# EAGLE design BPW21_transimpedance_amplifier (EAGLE 9.6.2)
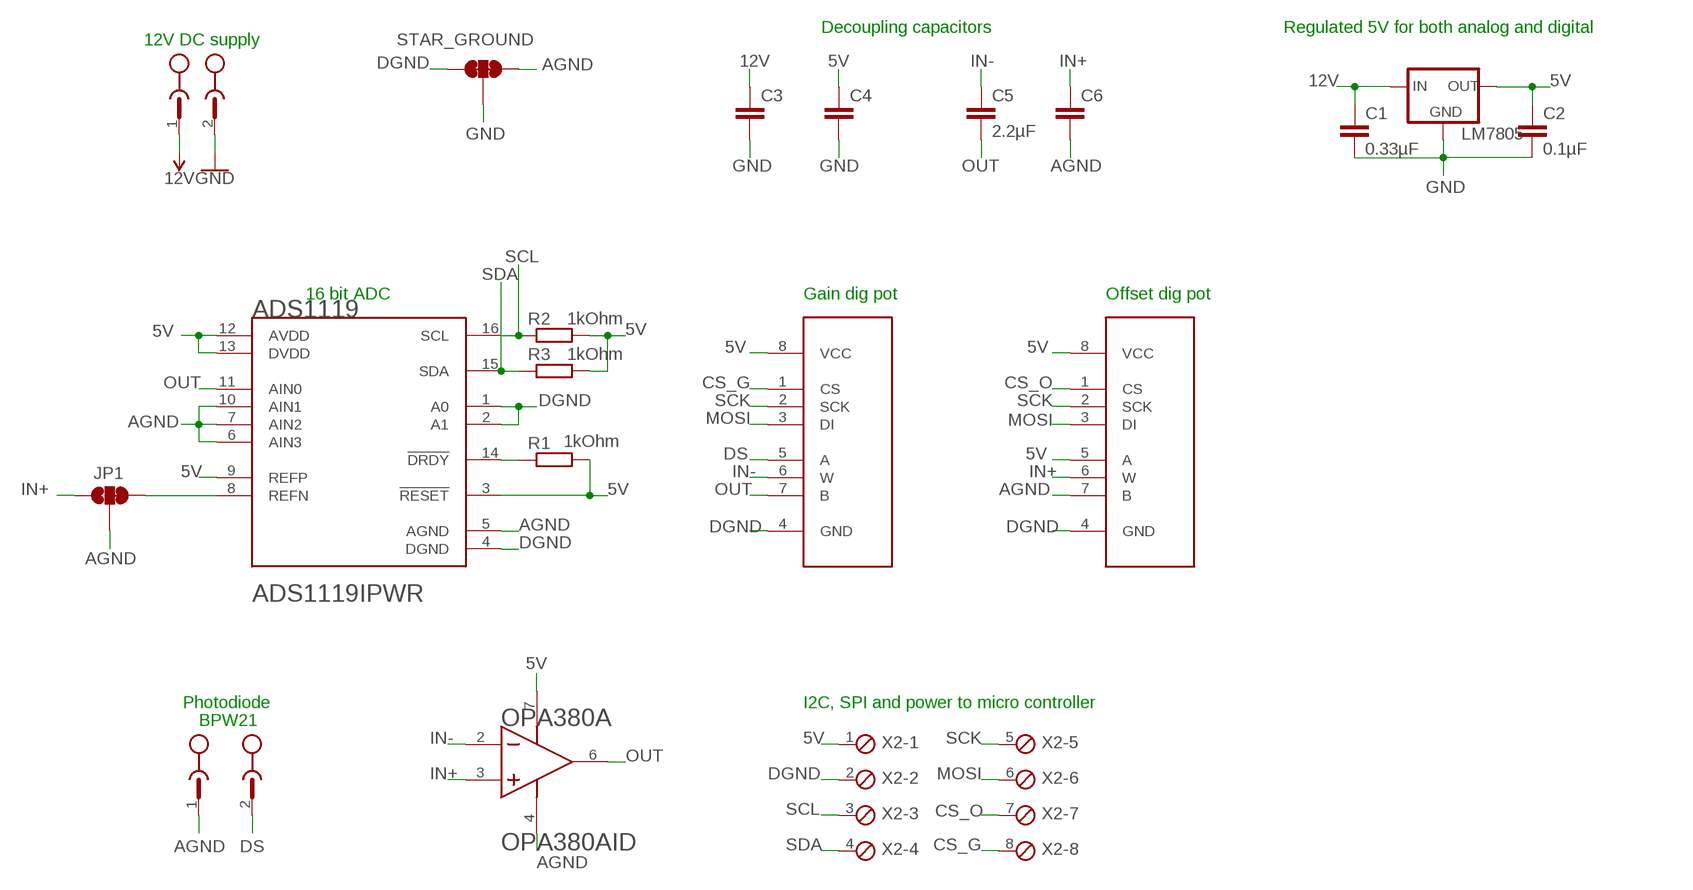
[diagram p0: schematic, sheet 1]

## Parts
ADS1119  TEXAS_INSTRUMENTS_ADS1119IPWRTEXAS_INSTRUMENTS_ADS1119IPWR_0_3  [TEXAS_INSTRUMENTS_ADS1119IPWR_3]
BPW21  MSTBA2  [MSTBA2]
C1  0.33µF  C-EUC0805  [C0805]
C2  0.1µF  C-EUC0805  [C0805]
C3  C-EUC0805  [C0805]
C4  C-EUC0805  [C0805]
C5  2.2µF  C-EUC0805  [C0805]
C6  C-EUC0805  [C0805]
GAIN_POT  MCP41XXX  MCP41XXXDIL  [DIP08]
JP1  JUMPER-SMT_3_1-NC_TRACE_NO-SILK  [SMT-JUMPER_3_1-NC_TRACE_NO-SILK]
LM7805  V_REG_78XX7812  [TO-252]
OFFSET_POT  MCP41XXX  MCP41XXXDIL  [DIP08]
OPA380  TEXAS_INSTRUMENTS_OPA380AIDTEXAS_INSTRUMENTS_OPA380AID_0_1  [TEXAS_INSTRUMENTS_OPA380AID_1]
R1  1kOhm  R-EU_R0805  [R0805]
R2  1kOhm  R-EU_R0805  [R0805]
R3  1kOhm  R-EU_R0805  [R0805]
STAR_GROUND  JUMPER-SMT_3_2-NC_TRACE_NO-SILK  [SMT-JUMPER_3_2-NC_TRACE_NO-SILK]
X2  MPT8  [8POL254]
X4  MSTBA2  [MSTBA2]

## Nets
5V: ADS1119.3(!RESET!) ADS1119.9(REFP) ADS1119.12(AVDD) ADS1119.13(DVDD) C2.1 C4.1 GAIN_POT.8(VCC) LM7805.2(OUT) OFFSET_POT.5(A) OFFSET_POT.8(VCC) OPA380.7(A:V+) R1.2 R2.2 R3.2 X2.1
12V: C1.1 C3.1 LM7805.1(IN) X4.1
AGND: ADS1119.5(AGND) ADS1119.6(AIN3) ADS1119.7(AIN2) ADS1119.10(AIN1) BPW21.1 C6.2 JP1.2 OFFSET_POT.7(B) OPA380.4(A:V-) STAR_GROUND.3
CS_G: GAIN_POT.1(CS) X2.8
CS_O: OFFSET_POT.1(CS) X2.7
DGND: ADS1119.1(A0) ADS1119.2(A1) ADS1119.4(DGND) GAIN_POT.4(GND) OFFSET_POT.4(GND) STAR_GROUND.1 X2.2
DS: BPW21.2 GAIN_POT.5(A)
GND: C1.2 C2.2 C3.2 C4.2 LM7805.3(GND) STAR_GROUND.2 X4.2
IN+: C6.1 JP1.1 OFFSET_POT.6(W) OPA380.3(A:IN+)
IN-: C5.1 GAIN_POT.6(W) OPA380.2(A:IN-)
MOSI: GAIN_POT.3(DI) OFFSET_POT.3(DI) X2.6
N$3: ADS1119.14(!DRDY!) R1.1
OUT: ADS1119.11(AIN0) C5.2 GAIN_POT.7(B) OPA380.6(A:OUT)
REFN: ADS1119.8(REFN) JP1.3
SCK: GAIN_POT.2(SCK) OFFSET_POT.2(SCK) X2.5
SCL: ADS1119.16(SCL) R2.1 X2.3
SDA: ADS1119.15(SDA) R3.1 X2.4
Unconnected: OPA380.1(B:1_NC) OPA380.5(B:2_NC) OPA380.8(B:3_NC)

## Notes on the sheet
- Decoupling capacitors | Regulated 5V for both analog and digital
- 12V DC supply
- 16 bit ADC | Gain dig pot | Offset dig pot
- Photodiode | I2C, SPI and power to micro controller
- BPW21

## Library data of the parts
ADS1119 = Texas Instruments - ADS1119IPWR:TEXAS_INSTRUMENTS_ADS1119IPWR: 16 Bit Analog to Digital Converter 4 Input 1 Sigma-Delta 16-TSSOP; AMBIENT_TEMPERATURE_RANGE_HIGH: +125°C; AMBIENT_TEMPERATURE_RANGE_LOW: -40°C; AUTOMOTIVE: No; CENTROID_NOT_SPECIFIED: No; DATASHEET: https://www.ti.com/lit/ds/symlink/ads1119.pdf?ts=1625816059223&ref_url=https%253A%252F%252Fwww.ti.com%252Fsitesearch%252Fdocs%252Funiversalsearch.tsp%253FlangPref%253Den-US%2526searchTerm%253DADS1119IPWR%2526nr%253D11; DATA_POLARITY: Single Ended/Differential; DEVICE_CLASS_L1: Integrated Circuits (ICs); DEVICE_CLASS_L2: Data Converter ICs; DEVICE_CLASS_L3: Analog to Digital Converters (ADCs); DIGIKEY_DESCRIPTION: IC ADC 16BIT SIGMA-DELTA 16TSSOP; DIGIKEY_PART_NUMBER: 296-50874-1-ND; FOOTPRINT_PARAMETERS_1: {"fp_type":"TSSOP2","params":{"N":{"nom":16,"long name":"Number of leads","min":null,"max":null,"short name":"N","type":"count"},"A":{"nom":false,"long name":"Height","min":false,"max":1200000,"short name":"A","type":"measurement"},"A1":{"nom":false,"long name":"Package clearance","min":50000,"max":150000,"short name":"A1","type":"measurement"},"A2":{"nom":false,"long name":"Package height","min":false,"max":1150000,"short name":"A2","type":"measurement"},"D":{"nom":false,"long name":"Package length","min":4900000,"max":5100000,"short name":"D","type":"measurement"},"E":{"nom":false,"long name":"Width /w leads","min":6200000,"max":6600000,"short name":"E","type":"measurement"},"E1":{"nom":false,"long name":"Package width","min":4300000,"max":4500000,"short name":"E1","type":"measurement"},"B":{"nom":false,"long name":"Lead width","min":190000,"max":300000,"short name":"B","type":"measurement"},"C":{"nom":150000,"long name":"Lead thickness","min":false,"max":false,"short name":"C","type":"measurement"},"L":{"nom":false,"long name":"Lead foot length","min":500000,"max":750000,"short name":"L","type":"measurement"},"e":{"nom":650000,"long name":"Lead pitch","min":null,"max":null,"short name":"e","type":"measurement"},"PHI":{"nom":false,"long name":"Lead angle","min":0,"max":8000000,"short name":"PHI","type":"measurement"},"HT":{"default":"No","long name":"Thermal pad","type":"multichoiceparent","short name":"HT","children":[]},"offset x":{"nom":0,"long name":"X Center offset","min":null,"max":null,"short name":"offset x","type":"measurement"},"offset y":{"nom":0,"long name":"Y Center offset","min":null,"max":null,"short name":"offset y","type":"measurement"},"LS":{"default":"Rounded rectangle","long name":"Land shape","type":"multichoice","short name":"LS"},"LS1":{"default":"Rectangle","long name":"Land shape (Pin 1)","type":"multichoice","short name":"LS1"},"solder toe":{"nom":550000,"long name":"Solder fillet (toe)","min":null,"max":null,"short name":"solder toe","type":"fixedmeasurement"},"solder heel":{"nom":450000,"long name":"Solder fillet (heel)","min":null,"max":null,"short name":"solder heel","type":"fixedmeasurement"},"solder side":{"nom":50000,"long name":"Solder fillet (side)","min":null,"max":null,"short name":"solder side","type":"fixedmeasurement"},"courtyard":{"nom":500000,"long name":"Courtyard","min":null,"max":null,"short name":"courtyard","type":"fixedmeasurement"},"SF":{"default":"A (> 0.625mm pitch)","long name":"Packing level","type":"multichoiceparent","short name":"SF","help":"http://support.upverter.com/customer/portal/articles/978783-what-is-a-footprint-packing-level","children":["solder toe","solder heel","solder side","courtyard"]}}}; FOOTPRINT_PARAMETERS_2: {"fp_type":"TSSOP2","params":{"N":{"nom":16,"long name":"Number of leads","min":null,"max":null,"short name":"N","type":"count"},"A":{"nom":false,"long name":"Height","min":false,"max":1200000,"short name":"A","type":"measurement"},"A1":{"nom":false,"long name":"Package clearance","min":50000,"max":150000,"short name":"A1","type":"measurement"},"A2":{"nom":false,"long name":"Package height","min":false,"max":1150000,"short name":"A2","type":"measurement"},"D":{"nom":false,"long name":"Package length","min":4900000,"max":5100000,"short name":"D","type":"measurement"},"E":{"nom":false,"long name":"Width /w leads","min":6200000,"max":6600000,"short name":"E","type":"measurement"},"E1":{"nom":false,"long name":"Package width","min":4300000,"max":4500000,"short name":"E1","type":"measurement"},"B":{"nom":false,"long name":"Lead width","min":190000,"max":300000,"short name":"B","type":"measurement"},"C":{"nom":150000,"long name":"Lead thickness","min":false,"max":false,"short name":"C","type":"measurement"},"L":{"nom":false,"long name":"Lead foot length","min":500000,"max":750000,"short name":"L","type":"measurement"},"e":{"nom":650000,"long name":"Lead pitch","min":null,"max":null,"short name":"e","type":"measurement"},"PHI":{"nom":false,"long name":"Lead angle","min":0,"max":8000000,"short name":"PHI","type":"measurement"},"HT":{"default":"No","long name":"Thermal pad","type":"multichoiceparent","short name":"HT","children":[]},"offset x":{"nom":0,"long name":"X Center offset","min":null,"max":null,"short name":"offset x","type":"measurement"},"offset y":{"nom":0,"long name":"Y Center offset","min":null,"max":null,"short name":"offset y","type":"measurement"},"LS":{"default":"Rounded rectangle","long name":"Land shape","type":"multichoice","short name":"LS"},"LS1":{"default":"Rectangle","long name":"Land shape (Pin 1)","type":"multichoice","short name":"LS1"},"solder toe":{"nom":350000,"long name":"Solder fillet (toe)","min":null,"max":null,"short name":"solder toe","type":"fixedmeasurement"},"solder heel":{"nom":350000,"long name":"Solder fillet (heel)","min":null,"max":null,"short name":"solder heel","type":"fixedmeasurement"},"solder side":{"nom":30000,"long name":"Solder fillet (side)","min":null,"max":null,"short name":"solder side","type":"fixedmeasurement"},"courtyard":{"nom":250000,"long name":"Courtyard","min":null,"max":null,"short name":"courtyard","type":"fixedmeasurement"},"SF":{"default":"B (> 0.625mm pitch)","long name":"Packing level","type":"multichoiceparent","short name":"SF","help":"http://support.upverter.com/customer/portal/articles/978783-what-is-a-footprint-packing-level","children":["solder toe","solder heel","solder side","courtyard"]}}}; FOOTPRINT_PARAMETERS_3: {"fp_type":"TSSOP2","params":{"N":{"nom":16,"long name":"Number of leads","min":null,"max":null,"short name":"N","type":"count"},"A":{"nom":false,"long name":"Height","min":false,"max":1200000,"short name":"A","type":"measurement"},"A1":{"nom":false,"long name":"Package clearance","min":50000,"max":150000,"short name":"A1","type":"measurement"},"A2":{"nom":false,"long name":"Package height","min":false,"max":1150000,"short name":"A2","type":"measurement"},"D":{"nom":false,"long name":"Package length","min":4900000,"max":5100000,"short name":"D","type":"measurement"},"E":{"nom":false,"long name":"Width /w leads","min":6200000,"max":6600000,"short name":"E","type":"measurement"},"E1":{"nom":false,"long name":"Package width","min":4300000,"max":4500000,"short name":"E1","type":"measurement"},"B":{"nom":false,"long name":"Lead width","min":190000,"max":300000,"short name":"B","type":"measurement"},"C":{"nom":150000,"long name":"Lead thickness","min":false,"max":false,"short name":"C","type":"measurement"},"L":{"nom":false,"long name":"Lead foot length","min":500000,"max":750000,"short name":"L","type":"measurement"},"e":{"nom":650000,"long name":"Lead pitch","min":null,"max":null,"short name":"e","type":"measurement"},"PHI":{"nom":false,"long name":"Lead angle","min":0,"max":8000000,"short name":"PHI","type":"measurement"},"HT":{"default":"No","long name":"Thermal pad","type":"multichoiceparent","short name":"HT","children":[]},"offset x":{"nom":0,"long name":"X Center offset","min":null,"max":null,"short name":"offset x","type":"measurement"},"offset y":{"nom":0,"long name":"Y Center offset","min":null,"max":null,"short name":"offset y","type":"measurement"},"LS":{"default":"Rounded rectangle","long name":"Land shape","type":"multichoice","short name":"LS"},"LS1":{"default":"Rectangle","long name":"Land shape (Pin 1)","type":"multichoice","short name":"LS1"},"solder toe":{"nom":150000,"long name":"Solder fillet (toe)","min":null,"max":null,"short name":"solder toe","type":"fixedmeasurement"},"solder heel":{"nom":250000,"long name":"Solder fillet (heel)","min":null,"max":null,"short name":"solder heel","type":"fixedmeasurement"},"solder side":{"nom":10000,"long name":"Solder fillet (side)","min":null,"max":null,"short name":"solder side","type":"fixedmeasurement"},"courtyard":{"nom":100000,"long name":"Courtyard","min":null,"max":null,"short name":"courtyard","type":"fixedmeasurement"},"SF":{"default":"C (> 0.625mm pitch)","long name":"Packing level","type":"multichoiceparent","short name":"SF","help":"http://support.upverter.com/customer/portal/articles/978783-what-is-a-footprint-packing-level","children":["solder toe","solder heel","solder side","courtyard"]}}}; FOOTPRINT_VARIANT_NAME_0: Recommended_Land_Pattern; FOOTPRINT_VARIANT_NAME_1: IPC_A; FOOTPRINT_VARIANT_NAME_2: IPC_B; FOOTPRINT_VARIANT_NAME_3: IPC_C; HEIGHT: 1.2mm; INTERFACE: I2C; LEAD_FREE: Yes; MAX_JUNCTION_TEMP: +150°C; MAX_SUPPLY_VOLTAGE: 5.5V; MF: Texas Instruments; MFG_PACKAGE_IDENT: PW0016A; MFG_PACKAGE_IDENT_COMPONENT_ID: 1c7b28e9f8e18a37; MFG_PACKAGE_IDENT_DATE: 0; MFG_PACKAGE_IDENT_REV: 0; MIN_SUPPLY_VOLTAGE: 2.3V; MOUSER_PART_NUMBER: 595-ADS1119IPWR; MPN: ADS1119IPWR; NOMINAL_SUPPLY_CURRENT: 65-310uA; NUMBER_OF_CHANNELS: 4; PACKAGE: TSSOP16; PREFIX: U; RESOLUTION: 16bits; ROHS: Yes; SAMPLING_RATE: 1ksps; STANDOFF_HEIGHT: 0.05mm; TEMPERATURE_RANGE_HIGH: +125°C; TEMPERATURE_RANGE_LOW: -40°C; VERIFICATION_VERSION: 0.0.0.3
BPW21 = con-phoenix-508:MSTBA2: PHOENIX; MF: FARNELL; MPN: 1757242; OC_FARNELL: 3705171; OC_NEWARK: 71C4161; SPICEPREFIX: X
C1-C6 = rcl:C-EU: CAPACITOR, European symbol; SPICEPREFIX: C
GAIN_POT OFFSET_POT = SparkFun-IC-Special-Function:MCP41XXX: Digital Potentiometer - 10K SPI controlled single digital potentiometer by Microchip Datasheet <http://cdn.sparkfun.com/datasheets/Components/General%20IC/22060b.pdf> SparkFun Products Storefront component: Digital Potentiometer - 10K <https://www.sparkfun.com/products/10613> (COM-10613); PROD_ID: RES-13155
JP1 = SparkFun-Jumpers:JUMPER-SMT_3_1-NC_TRACE: Normally closed trace jumper (1 of 2 connections) This jumper has a trace between two pads so it's normally closed (NC). The other connection is normally open (NO). Use a razor knife to open the connection. For best results follow the IPC guidelines for cutting traces: Cutout at least 0.063 mm (0.005 in). Remove all loose material to clean up the cut area. Seal the cut with an approved epoxy. Reapply solder to reclose the connection, or to close the NO connection.
LM7805 = SparkFun-IC-Power:V_REG_78XX: Voltage Regulator Standard 78xx regulator. IGO (Input Ground Output). Spark Fun Electronics SKU : COM-00107; PROD_ID: VREG-12370; VALUE: +12v
OPA380 = Texas Instruments - OPA380AID:TEXAS_INSTRUMENTS_OPA380AID: TI-AMP-S3-2-8_B; CIIVA_IDS: 13608760; CODE__JEDEC: MS-012; COMPONENT_LINK_1_DESCRIPTION: Manufacturer URL; COMPONENT_LINK_1_URL: http://www.ti.com/; COMPONENT_LINK_3_DESCRIPTION: Package Specification; COMPONENT_LINK_3_URL: http://www.ti.com/litv/pdf/msoi002j; DATASHEET: http://www.ti.com/general/docs/lit/getliterature.tsp?genericPartNumber=OPA380&fileType=pdf; DATASHEET_VERSION: SBOS291G; FOOTPRINT_VARIANT_NAME_0: Level C; FOOTPRINT_VARIANT_NAME_1: Level B; FOOTPRINT_VARIANT_NAME_2: Level A; IIB_MAXN_A: 0.05; IMPORTED: yes; IMPORTED_FROM: vault; IMPORT_TS: 1521866602; IQ_PER_CHANNELMAXMA: 8.8; MF: Texas Instruments; MOUNTING_TECHNOLOGY: Surface Mount; MPN: OPA380AID; NUMBER_OF_CHANNELS: 1; PACKAGE: D0008A; PACKAGE_DESCRIPTION: 8-Pin Plastic Small Outline, Body 4.9 x 3.9 mm, Pitch 1.27 mm; PACKAGE_VERSION: 4040047-3/M, 06/2011; PREFIX: U; RELEASE_DATE: 1464165570; ROHS: Yes; SLEW_RATETYPVUS: 80; VAULT_GUID: FC7C77FF-66D4-48C1-96A7-973F79AE3CD6; VAULT_REVISION: 31D8A9EE-7580-43E9-81B9-8C9C8A2136D3; VIO_MAXM_V: 0.025; VN_AT_FLATBANDTYPNVRTHZ: 3; VS_MAX_V: 5.5; VS_MIN_V: 2.7
R1-R3 = rcl:R-EU_: RESISTOR, European symbol; SPICEPREFIX: R
STAR_GROUND = SparkFun-Jumpers:JUMPER-SMT_3_2-NC_TRACE: Normally closed trace jumper (2 of 2 connections) This jumper has a trace between all three pads so they are normally closed (NC). Use a razor knife to open the connection(s). For best results follow the IPC guidelines for cutting traces: Cutout at least 0.063 mm (0.005 in). Remove all loose material to clean up the cut area. Seal the cut with an approved epoxy. Reapply solder to reclose the connection(s).
X2 = con-phoenix-254:MPT8: PHOENIX CONNECTOR; OC_FARNELL: unknown; OC_NEWARK: unknown
X4 = con-phoenix-508:MSTBA2: PHOENIX; MF: FARNELL; MPN: 1757242; OC_FARNELL: 3705171; OC_NEWARK: 71C4161

## Board
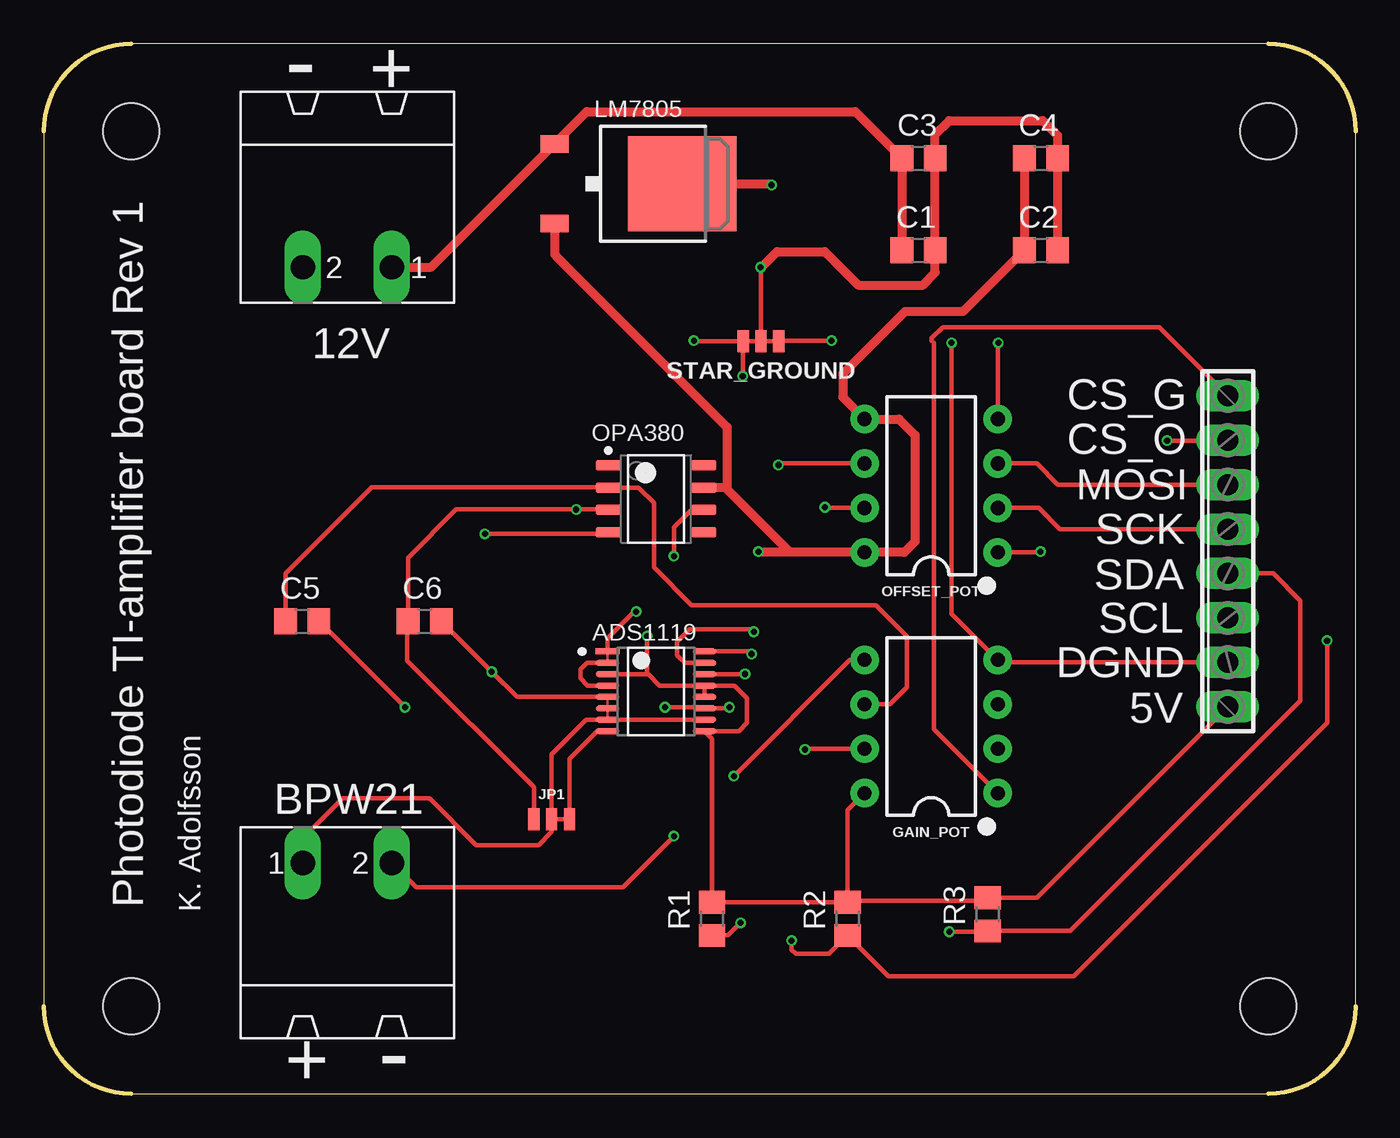
[diagram p1: board, top side]
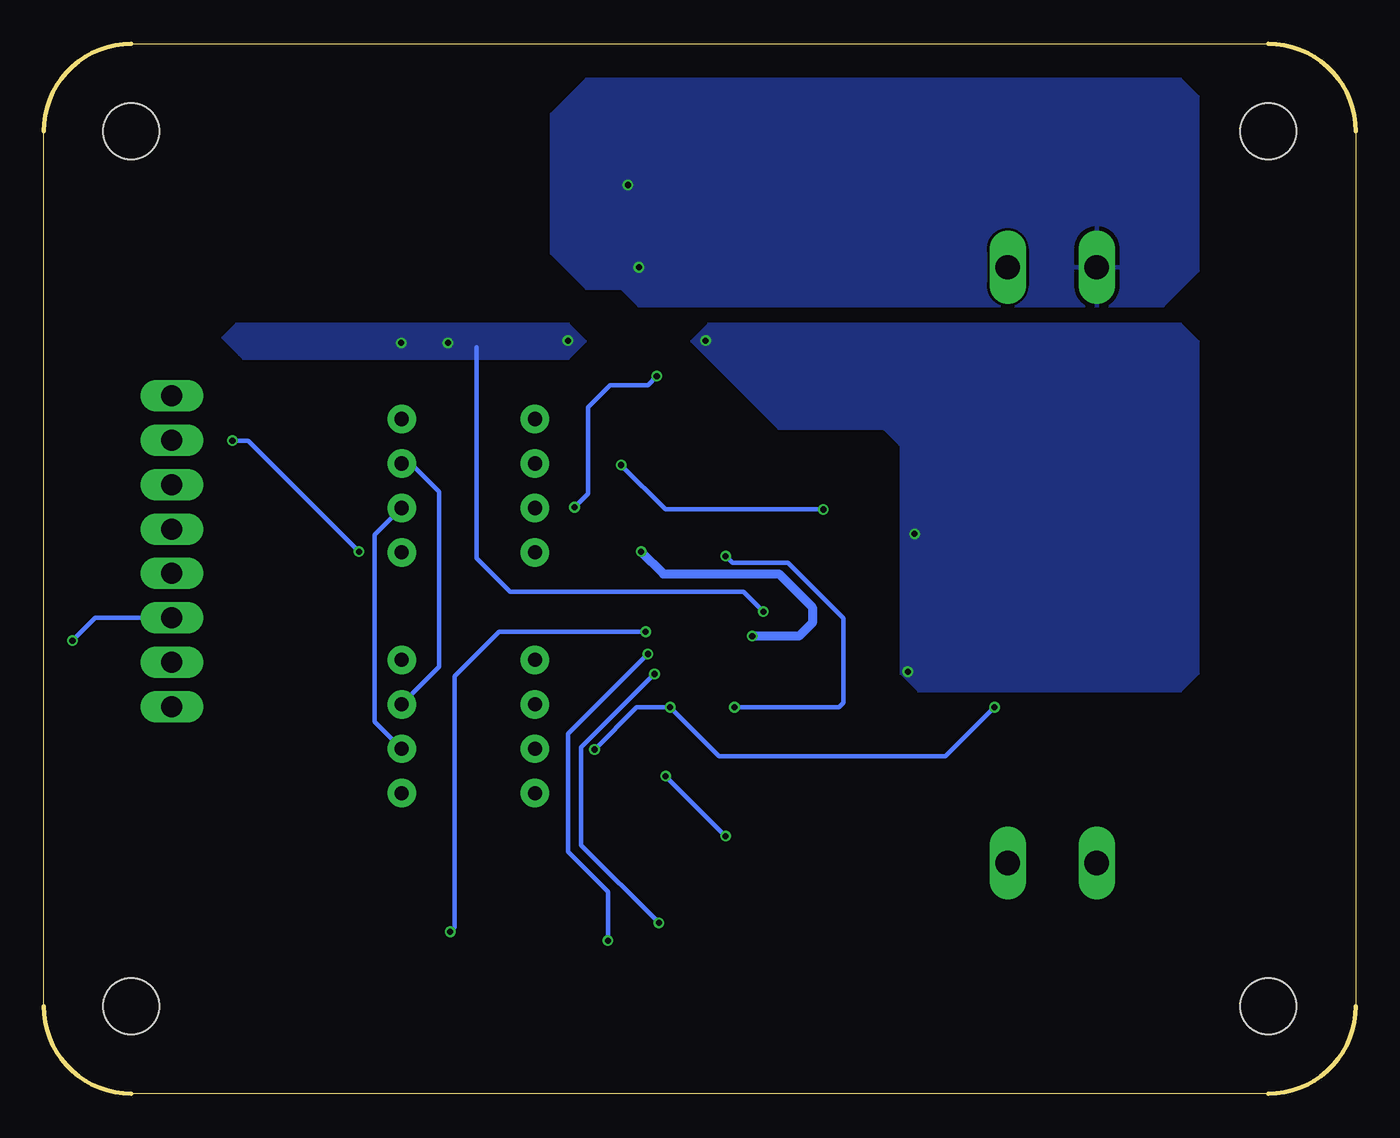
[diagram p2: board, bottom side, seen from below]

Size 75 x 60 mm. Coordinates in mm from the lower left corner, seen from the top.
Outline: 5,0 70,0 arc90 75,5 75,55 arc90 70,60 5,60 arc90 0,55 0,5 arc90 5,0
Copper layers (1*16): Top 0.035559375mm / dielectric 1.6mm / Bottom 0.035559375mm
Design rules "oshpark-2layer *": minimum track width 6mil, minimum drill 10mil, track to track 6mil, track to pad 6mil, pad to pad 6mil, via to via 6mil, smd to smd 0.1mm, copper to edge 15mil, drill to drill 6mil, minimum pad ring 5mil, minimum via ring 5mil, stop-mask expansion 2.5mil, vias tented up to drill 0mil, thermal gap 10mil
Holes 3.2 mm at 70,55 70,5 5,5 5,55

### Footprints (pad centres in the part's own frame; a part is rotated, then mirrored left to right if it is on the bottom)
TEXAS_INSTRUMENTS_ADS1119IPWR_3 = smd 1.355 x 0.341: 1 -2.775,2.275; 2 -2.775,1.625; 3 -2.775,0.975; 4 -2.775,0.325; 5 -2.775,-0.325; 6 -2.775,-0.975; 7 -2.775,-1.625; 8 -2.775,-2.275; 9 2.775,-2.275; 10 2.775,-1.625; 11 2.775,-0.975; 12 2.775,-0.325; 13 2.775,0.325; 14 2.775,0.975; 15 2.775,1.625; 16 2.775,2.275
MSTBA2 = drill 1.397 long: 1 -2.54,5.08; 2 2.54,5.08
C0805 = smd 1.3 x 1.5: 1 -0.95,0; 2 0.95,0
DIP08 = drill 0.813 pad 1.626: 1 -3.81,-3.81; 2 -1.27,-3.81; 3 1.27,-3.81; 4 3.81,-3.81; 5 3.81,3.81; 6 1.27,3.81; 7 -1.27,3.81; 8 -3.81,3.81
SMT-JUMPER_3_1-NC_TRACE_NO-SILK = smd 0.635 x 1.27: 1 -1.016,0; 2 0,0; 3 1.016,0
TO-252 = smd 1 x 1.6: 1 -2.28,-4.8; 2 2.28,-4.8 | smd 5.4 x 6.2: 3 0,2.5
TEXAS_INSTRUMENTS_OPA380AID_1 = smd 1.45 x 0.6: 1 -2.725,1.905; 2 -2.725,0.635; 3 -2.725,-0.635; 4 -2.725,-1.905; 5 2.725,-1.905; 6 2.725,-0.635; 7 2.725,0.635; 8 2.725,1.905
R0805 = smd 1.3 x 1.5: 1 -0.95,0; 2 0.95,0
SMT-JUMPER_3_2-NC_TRACE_NO-SILK = smd 0.635 x 1.27: 1 -1.016,0; 2 0,0; 3 1.016,0
8POL254 = drill 1.2 long: 1 -8.89,0; 2 -6.35,0; 3 -3.81,0; 4 -1.27,0; 5 1.27,0; 6 3.81,0; 7 6.35,0; 8 8.89,0

### Placement (x,y rotation side)
ADS1119  35,23 0 top
BPW21  17.35,8.11 0 top
C1  50,48.21 0 top
C2  57,48.21 0 top
C3  50,53.46 0 top
C4  57,53.46 0 top
C5  14.78,27 0 top
C6  21.78,27 0 top
GAIN_POT  50.73,20.98 90 top
JP1  29.03,15.68 0 top
LM7805  34,52 270 top
OFFSET_POT  50.73,34.75 90 top
OPA380  35,34 0 top
R1  38.21,10 90 top
R2  45.95,10 90 top
R3  53.95,10.25 90 top
STAR_GROUND  41,43 180 top
X2  67.68,31 90 top
X4  17.35,52.31 180 top

### Tracks (layer width: path | path; a pad name or v marks a point on that pad's centre or on a via)
5V  (via drill 0.35)
  Top 0.254: 45.95,11.04 R2.2 R1.2 38.21,20.29 ADS1119.9 39.74,20.73 40.21,21.2 40.21,22.59 39.48,23.33 ADS1119.13 | 45.95,11.04 45.95,16.21 GAIN_POT.8 | 45.95,11.04 53.78,11.04 R3.2 56.78,11.2 X2.1 | 49.19,30.94 OFFSET_POT.8 42.66,30.94 | 37.93,34.63 OPA380.7 | 42.66,30.94 42.5,31.1 | 29.2,47.95 29.29,47.87 | 39.07,34.74 38.96,34.63 | ADS1119.13 ADS1119.12 | ADS1119.3 34.56,23.98 | ADS1119.13 35.21,23.33 34.56,23.98 | 42.66,30.94 40.88,30.94 | v34.5,26.15 34.5,24.04 34.56,23.98
  Top 0.508: LM7805.2 29.2,47.95 | 29.29,47.87 39.07,38.09 39.07,34.74 | 37.93,34.63 38.96,34.63 42.5,31.1 | C4.1 C2.1 52.53,44.69 49.23,44.69 45.67,41.13 45.67,39.8 OFFSET_POT.5 48.89,38.56 49.8,37.64 49.8,31.55 49.19,30.94 40.88,30.94 v40.85,30.97
  Bottom 0.508: v40.85,30.97 39.58,29.7 32.97,29.7 31.07,27.8 31.07,26.91 31.83,26.15 v34.5,26.15
12V
  Top 0.508: X4.1 22.15,47.23 LM7805.1 31.04,56.12 46.39,56.12 C3.1 C1.1
AGND  (via drill 0.35)
  Top 0.152: ADS1119.7 ADS1119.6 ADS1119.5
  Top 0.254: OFFSET_POT.7 44.7,33.48 v44.66,33.51 | v37.16,43.04 37.2,43 STAR_GROUND.3 39.96,42.97 v39.96,41.01 | OPA380.4 32.17,31.99 v25.23,31.99 | ADS1119.5 27.05,22.67 v25.61,24.12 C6.2 | ADS1119.10 ADS1119.7 30.99,21.38 29.03,19.41 JP1.2 29.03,14.97 28.27,14.21 24.72,14.21 22.05,16.88 17.1,16.88 14.81,14.59 BPW21.1
  Bottom 0.254: v44.66,33.51 43.9,34.28 43.9,39.23 42.62,40.5 40.47,40.5 v39.96,41.01
  pour Bottom: 38,43 37,44 10,44 9,43 9,24 10,23 25,23 26,24 26,37 27,38 33,38
CS_G
  Top 0.254: GAIN_POT.1 50.88,20.83 50.88,42.91 50.75,43.04 50.75,43.17 51.39,43.8 63.77,43.8 X2.8
CS_O  (via drill 0.35)
  Top 0.254: OFFSET_POT.1 56.94,30.94 v56.98,30.97 | v64.22,37.32 67.66,37.32 X2.7
  Bottom 0.254: v56.98,30.97 63.33,37.32 v64.22,37.32
DGND  (via drill 0.35)
  Top 0.152: ADS1119.1 ADS1119.2
  Top 0.254: X2.2 54.68,24.65 GAIN_POT.4 54.52,24.79 51.9,27.42 v51.9,42.91 | STAR_GROUND.1 42.05,43.04 v45.04,43.04 | OFFSET_POT.4 54.54,42.89 v54.56,42.91 | ADS1119.4 31.1,23.33 30.69,23.73 30.69,24.24 31.07,24.62 ADS1119.2 | ADS1119.1 32.23,26.03 33.73,27.55 v33.86,27.55
  Bottom 0.254: v33.86,27.55 35.01,28.69 48.34,28.69 50.24,30.59 50.24,42.66
  pour Bottom: 44,43 45,44 64,44 64.8,43.2 63.84,42.24 63.59,42 45,42
DS  (via drill 0.35)
  Top 0.254: v36.02,14.72 33.1,11.8 21.29,11.8 BPW21.2 | v39.45,18.15 46.1,24.79 GAIN_POT.5
  Bottom 0.254: v36.02,14.72 v39.45,18.15
GND  (via drill 0.35)
  Top 0.254: 57.95,54.77 C4.2 C2.2 | STAR_GROUND.2 41,47.2 | 41,47.2 v40.97,47.23 | 41.91,48.12 41,47.2 | 41.55,51.99 v41.61,51.93
  Top 0.508: LM7805.3 41.54,52 41.55,51.99 | C4.2 57.95,54.77 57.1,55.61 51.77,55.61 50.95,54.79 C3.2 C1.2 50.95,46.92 50.24,46.21 46.56,46.21 44.66,48.12 41.91,48.12 41.03,47.23 v40.97,47.23 | C4.2 C2.2
  pour Bottom: 41,45 42,46 44,46 46,48 46,56 44,58 10,58 9,57 9,47 11,45
IN+  (via drill 0.35)
  Top 0.254: JP1.1 28.02,17.52 20.78,24.75 20.78,26.95 C6.1 20.83,30.64 23.57,33.39 v30.43,33.39 32.25,33.39 OPA380.3 | v41.99,35.93 42.08,36.02 OFFSET_POT.6
  Bottom 0.254: v30.43,33.39 39.45,33.39 v41.99,35.93
IN-
  Top 0.254: C5.1 13.83,29.74 18.75,34.66 32.25,34.66 OPA380.2 34.01,34.63 34.88,33.77 34.88,30.09 37.04,27.93 47.58,27.93 49.36,26.15 49.36,23.23 48.38,22.25 GAIN_POT.6
MOSI
  Top 0.254: X2.6 57.97,34.81 56.76,36.02 OFFSET_POT.3
  Bottom 0.254: GAIN_POT.3 52.4,24.39 52.4,34.4 54.02,36.02 OFFSET_POT.3
N$3  (via drill 0.35)
  Top 0.254: ADS1119.14 40.07,23.98 v40.09,23.99 | v39.83,9.77 39.12,9.05 R1.1
  Bottom 0.254: v40.09,23.99 44.28,19.8 44.28,14.21 v39.83,9.77
OUT  (via drill 0.35)
  Top 0.254: ADS1119.11 38.05,22.02 | 38.05,22.02 39.14,22.02 v39.2,22.08 | v43.51,19.67 43.56,19.71 GAIN_POT.7 | v20.65,22.08 C5.2 | OPA380.6 37.02,33.37 36.02,32.37 v36.02,30.72 | v35.51,22.08 37.99,22.08 38.05,22.02
  Bottom 0.254: v43.51,19.67 41.1,22.08 v39.2,22.08 36.4,19.29 23.45,19.29 v20.65,22.08 | v36.02,30.72 35.64,30.34 32.47,30.34 29.29,27.16 29.29,22.34 29.54,22.08 v35.51,22.08
REFN
  Top 0.254: ADS1119.8 31.62,20.73 30.05,19.15 JP1.3
SCK
  Top 0.254: X2.5 58.09,32.27 56.89,33.48 OFFSET_POT.2
  Bottom 0.254: GAIN_POT.2 56.09,21.26 56.09,31.93 OFFSET_POT.2
SCL  (via drill 0.35)
  Top 0.254: v73.36,25.89 73.36,21.2 58.88,6.72 48.28,6.72 R2.1 44.89,7.99 43.01,7.99 42.75,8.24 v42.75,8.75 | ADS1119.16 40.32,25.27 v40.47,25.13
  Bottom 0.254: v73.36,25.89 72.06,27.19 X2.3 | v40.47,25.13 45.04,20.56 45.04,13.83 42.75,11.54 v42.75,8.75
SDA  (via drill 0.35)
  Top 0.254: X2.4 70.28,29.73 71.83,28.18 71.83,22.47 58.67,9.3 R3.1 53.91,9.26 v51.77,9.26 | ADS1119.15 36.66,24.62 36.21,25.07 36.21,25.83 36.91,26.53 40.47,26.53 v40.59,26.4
  Bottom 0.254: v40.59,26.4 48.98,26.4 51.52,23.86 51.52,9.51 v51.77,9.26

### Text on the board
tNames: - | + | 12V | CS_G | CS_O | MOSI | SCK | SDA | SCL | DGND | 5V | Photodiode TI-amplifier board Rev 1 | K. Adolfsson | + | -